# EAGLE design untitled (EAGLE 7.4.0)
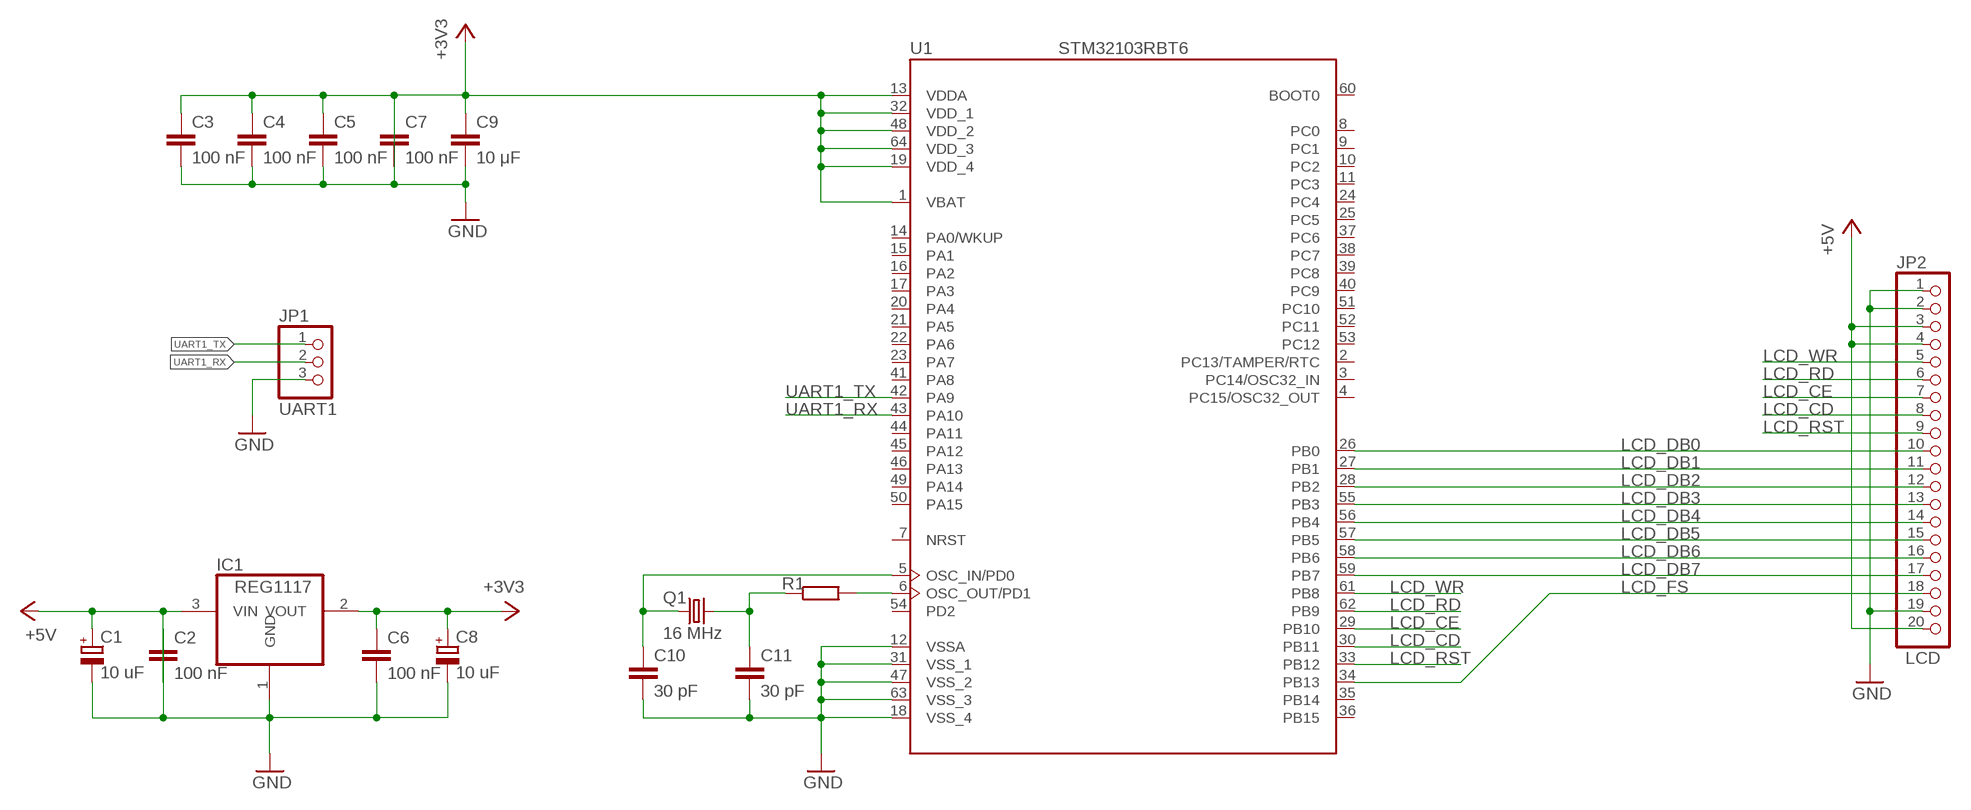
[diagram p0: schematic, sheet 1]

## Parts
C1  10 uF  CPOL-EUA/3216-18W  [A/3216-18W]
C2  100 nF  C-EUC1206  [C1206]
C3  100 nF  C-EUC1206  [C1206]
C4  100 nF  C-EUC1206  [C1206]
C5  100 nF  C-EUC1206  [C1206]
C6  100 nF  C-EUC1206  [C1206]
C7  100 nF  C-EUC1206  [C1206]
C8  10 uF  CPOL-EUA/3216-18W  [A/3216-18W]
C9  10 μF  C-EUC1206  [C1206]
C10  30 pF  C-EUC1206  [C1206]
C11  30 pF  C-EUC1206  [C1206]
IC1  REG1117  [SOT223]
JP1  PINHD-1X3  [1X03]
JP2  PINHD-1X20  [1X20]
Q1  16 MHz  CRYSTALHC49S  [HC49/S]
R1  R-EU_R1206  [R1206]
U1  STM32103RBT6  [LQFP64]

## Nets
+3V3: C3.1 C4.1 C5.1 C6.1 C7.2 C8.+ C9.1 IC1.2(VOUT) U1.1(VBAT) U1.13(VDDA) U1.19(VDD_4) U1.32(VDD_1) U1.48(VDD_2) U1.64(VDD_3)
+5V: C1.+ C2.2 IC1.3(VIN) JP2.3 JP2.4 JP2.20
GND: C1.- C2.1 C3.2 C4.2 C5.2 C6.2 C7.1 C8.- C9.2 C10.2 C11.2 IC1.1(GND) JP1.3 JP2.1 JP2.2 JP2.19 U1.12(VSSA) U1.18(VSS_4) U1.31(VSS_1) U1.47(VSS_2) U1.63(VSS_3)
LCD_CD: JP2.8 U1.30(PB11)
LCD_CE: JP2.7 U1.29(PB10)
LCD_DB0: JP2.10 U1.26(PB0)
LCD_DB1: JP2.11 U1.27(PB1)
LCD_DB2: JP2.12 U1.28(PB2)
LCD_DB3: JP2.13 U1.55(PB3)
LCD_DB4: JP2.14 U1.56(PB4)
LCD_DB5: JP2.15 U1.57(PB5)
LCD_DB6: JP2.16 U1.58(PB6)
LCD_DB7: JP2.17 U1.59(PB7)
LCD_FS: JP2.18 U1.34(PB13)
LCD_RD: JP2.6 U1.62(PB9)
LCD_RST: JP2.9 U1.33(PB12)
LCD_WR: JP2.5 U1.61(PB8)
N$1: C10.1 Q1.1 U1.5(OSC_IN/PD0)
N$2: C11.1 Q1.2 R1.1
N$3: R1.2 U1.6(OSC_OUT/PD1)
UART1_RX: JP1.2 U1.43(PA10)
UART1_TX: JP1.1 U1.42(PA9)
Unconnected: U1.2(PC13/TAMPER/RTC) U1.3(PC14/OSC32_IN) U1.4(PC15/OSC32_OUT) U1.7(NRST) U1.8(PC0) U1.9(PC1) U1.10(PC2) U1.11(PC3) U1.14(PA0/WKUP) U1.15(PA1) U1.16(PA2) U1.17(PA3) U1.20(PA4) U1.21(PA5) U1.22(PA6) U1.23(PA7) U1.24(PC4) U1.25(PC5) U1.35(PB14) U1.36(PB15) U1.37(PC6) U1.38(PC7) U1.39(PC8) U1.40(PC9) U1.41(PA8) U1.44(PA11) U1.45(PA12) U1.46(PA13) U1.49(PA14) U1.50(PA15) U1.51(PC10) U1.52(PC11) U1.53(PC12) U1.54(PD2) U1.60(BOOT0)

## Notes on the sheet
- UART1
- LCD

## Library data of the parts
C1 C8 = rcl:CPOL-EU: POLARIZED CAPACITOR, European symbol
C2-C7 C9-C11 = resistor:C-EU: CAPACITOR, European symbol
IC1 = burr-brown:REG1117: 800mA and 1A Low Dropout (LDO) Positive Regulator 1.8V, 2.5V, 2.85V, 3.3V, 5V, and Adj; MPN: REG1117; OC_FARNELL: 1097566; OC_NEWARK: 14P6981
JP1 = pinhead:PINHD-1X3: PIN HEADER
JP2 = pinhead:PINHD-1X20: PIN HEADER
Q1 = crystal:CRYSTAL: CRYSTAL; OC_FARNELL: 1667008; OC_NEWARK: unknown
R1 = resistor:R-EU_: RESISTOR, European symbol
U1 = MyLib:STM32103RBT6: STM32F103RxTx

## Board
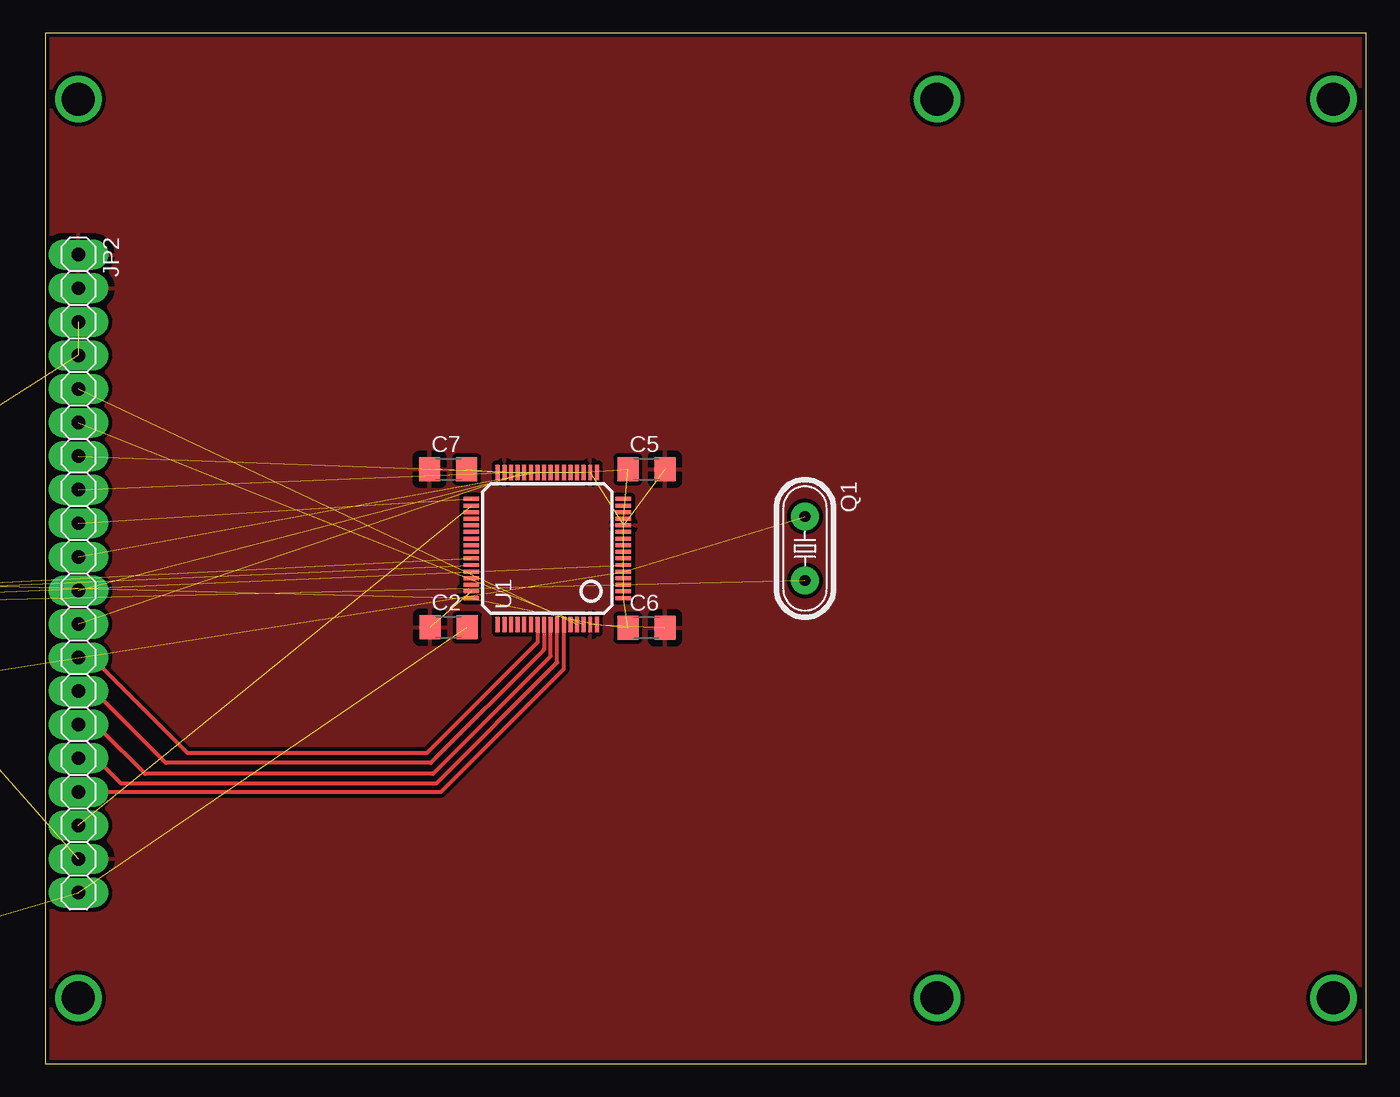
[diagram p1: board, top side]

Size 100 x 78 mm. Coordinates in mm from the lower left corner, seen from the top.
Outline: 0,0 100,0 100,78 0,78 0,0
Copper layers (1*16): Top 0.035mm / dielectric 1.5mm / Bottom 0.035mm
Design rules "default *": minimum track width 12mil, minimum drill 32mil, track to track 12mil, track to pad 12mil, pad to pad 12mil, via to via 12mil, smd to smd 8mil, copper to edge 12mil, drill to drill 40mil, minimum pad ring 25mil, minimum via ring 12mil, stop-mask expansion 4mil, vias tented up to drill 0mil, thermal gap 20mil

### Footprints (pad centres in the part's own frame; a part is rotated, then mirrored left to right if it is on the bottom)
A/3216-18W = smd 2.15 x 1.8: + 1.475,0; - -1.475,0
C1206 = smd 1.6 x 1.8: 1 -1.4,0; 2 1.4,0
SOT223 = smd 1.499 x 2.007: 1 -2.261,-3.15; 2 0.025,-3.15; 3 2.311,-3.15 | smd 3.81 x 2.007: 4 0,3.15
1X03 = drill 1.016 long: 1 -2.54,0; 2 0,0; 3 2.54,0
1X20 = drill 1.016 long: 1 -24.13,0; 2 -21.59,0; 3 -19.05,0; 4 -16.51,0; 5 -13.97,0; 6 -11.43,0; 7 -8.89,0; 8 -6.35,0; 9 -3.81,0; 10 -1.27,0; 11 1.27,0; 12 3.81,0; 13 6.35,0; 14 8.89,0; 15 11.43,0; 16 13.97,0; 17 16.51,0; 18 19.05,0; 19 21.59,0; 20 24.13,0
HC49/S = drill 0.813: 1 -2.413,0; 2 2.413,0
R1206 = smd 1.6 x 1.803: 1 -1.422,0; 2 1.422,0
LQFP64 = smd 0.3 x 1.2: 1 -3.75,-5.75; 2 -3.25,-5.75; 3 -2.75,-5.75; 4 -2.25,-5.75; 5 -1.75,-5.75; 6 -1.25,-5.75; 7 -0.75,-5.75; 8 -0.25,-5.75; 9 0.25,-5.75; 10 0.75,-5.75; 11 1.25,-5.75; 12 1.75,-5.75; 13 2.25,-5.75; 14 2.75,-5.75; 15 3.25,-5.75; 16 3.75,-5.75; 33 3.75,5.75; 34 3.25,5.75; 35 2.75,5.75; 36 2.25,5.75; 37 1.75,5.75; 38 1.25,5.75; 39 0.75,5.75; 40 0.25,5.75; 41 -0.25,5.75; 42 -0.75,5.75; 43 -1.25,5.75; 44 -1.75,5.75; 45 -2.25,5.75; 46 -2.75,5.75; 47 -3.25,5.75; 48 -3.75,5.75 | smd 1.2 x 0.3: 17 5.75,-3.75; 18 5.75,-3.25; 19 5.75,-2.75; 20 5.75,-2.25; 21 5.75,-1.75; 22 5.75,-1.25; 23 5.75,-0.75; 24 5.75,-0.25; 25 5.75,0.25; 26 5.75,0.75; 27 5.75,1.25; 28 5.75,1.75; 29 5.75,2.25; 30 5.75,2.75; 31 5.75,3.25; 32 5.75,3.75; 49 -5.75,3.75; 50 -5.75,3.25; 51 -5.75,2.75; 52 -5.75,2.25; 53 -5.75,1.75; 54 -5.75,1.25; 55 -5.75,0.75; 56 -5.75,0.25; 57 -5.75,-0.25; 58 -5.75,-0.75; 59 -5.75,-1.25; 60 -5.75,-1.75; 61 -5.75,-2.25; 62 -5.75,-2.75; 63 -5.75,-3.25; 64 -5.75,-3.75

### Placement (x,y rotation side)
C1  -25.4,36.83 0 top  (outside the outline)
C2  30.52,33.03 0 top
C3  -40.64,17.78 0 top  (outside the outline)
C4  -33.02,17.78 0 top  (outside the outline)
C5  45.5,45 0 top
C6  45.5,33 0 top
C7  30.5,45 0 top
C8  -31.75,36.83 0 top  (outside the outline)
C9  -31.75,24.13 0 top  (outside the outline)
C10  -38.1,24.13 0 top  (outside the outline)
C11  -44.45,24.13 0 top  (outside the outline)
IC1  -33.02,6.35 0 top  (outside the outline)
JP1  -17.78,35.56 0 top  (outside the outline)
JP2  2.5,37.1 270 top
Q1  57.5,39 270 top
R1  -38.1,34.29 0 top  (outside the outline)
U1  38,39 90 top

### Tracks (layer width: path | path; a pad name or v marks a point on that pad's centre or on a via)
+3V3  (13 unrouted)
+5V  (5 unrouted)
GND  (14 unrouted)
  pour Top: -0.5,78.5 -0.5,-0.5 100.5,-0.5 100.5,78.5
LCD_CD  (1 unrouted)
LCD_CE  (1 unrouted)
LCD_DB0  (1 unrouted)
LCD_DB1  (1 unrouted)
LCD_DB2  (1 unrouted)
LCD_DB3
  Top 0.3: U1.55 37.25,31.9 28.88,23.52 10.78,23.52 4.4,29.9 3.35,29.9 JP2.13
LCD_DB4
  Top 0.3: U1.56 37.75,31.35 29.18,22.77 9.12,22.77 4.2,27.7 3.01,27.7 JP2.14
LCD_DB5
  Top 0.3: U1.57 38.25,30.85 29.35,21.95 7.55,21.95 4.2,25.3 2.87,25.3 JP2.15
LCD_DB6
  Top 0.3: U1.58 38.75,30.38 29.57,21.2 5.75,21.2 3.83,23.12 JP2.16
LCD_DB7
  Top 0.3: JP2.17 29.94,20.59 39.25,29.9 U1.59
LCD_FS  (1 unrouted)
LCD_RD  (1 unrouted)
LCD_RST  (1 unrouted)
LCD_WR  (1 unrouted)
N$1  (2 unrouted)
N$2  (2 unrouted)
N$3  (1 unrouted)
N$4  (via drill 2.5)
  other vias: 97.5,73
N$5  (via drill 2.5)
  other vias: 97.5,5
N$6  (via drill 2.5)
  other vias: 67.5,5
N$7  (via drill 2.5)
  other vias: 67.5,73
N$8  (via drill 2.5)
  other vias: 2.5,73
N$9  (via drill 2.5)
  other vias: 2.5,5
UART1_RX  (1 unrouted)
UART1_TX  (1 unrouted)